# Altium schematic sheet PROC051D_SOP_Headers_Reference.SchDoc
size 431 x 279 mm; Date: Not shown in title block; ApprovedBy: Not shown in title block; CheckedBy: Not shown in title block; Author: Not shown in title block; CompanyName: Not shown in title block; Engineer: Not shown in title block; Organization: Not shown in title block; Address1: Not shown in title block; Address2: Not shown in title block; Address3: Not shown in title block; Address4: Not shown in title block; DocumentNumber: 7; Revision: Use project parameter SCH_Rev; SheetNumber: 7; SheetTotal: 16; PageSetup: Record=PageOptions|CenterHorizontal=True|CenterVertical=True|PrintScale=1.00|XCorrection=1.00|YCorrection=1.00|PrintKind=0|BorderSize=5000000|LeftOffset=0|BottomOffset=0|Orientation=2|PaperLength=1000|PaperWidth=1000|Scale=100|PaperSource=15|PrintQuality=600|MediaType=1|DitherType=10|PaperKind=Letter|PrintScaleMode=1; CurrentTime: Not shown in title block; CurrentDate: Not shown in title block; Time: Not shown in title block; DocumentFullPathAndName: Not shown in title block; DocumentName: Not shown in title block; ModifiedDate: Not shown in title block; ImagePath: Not shown in title block
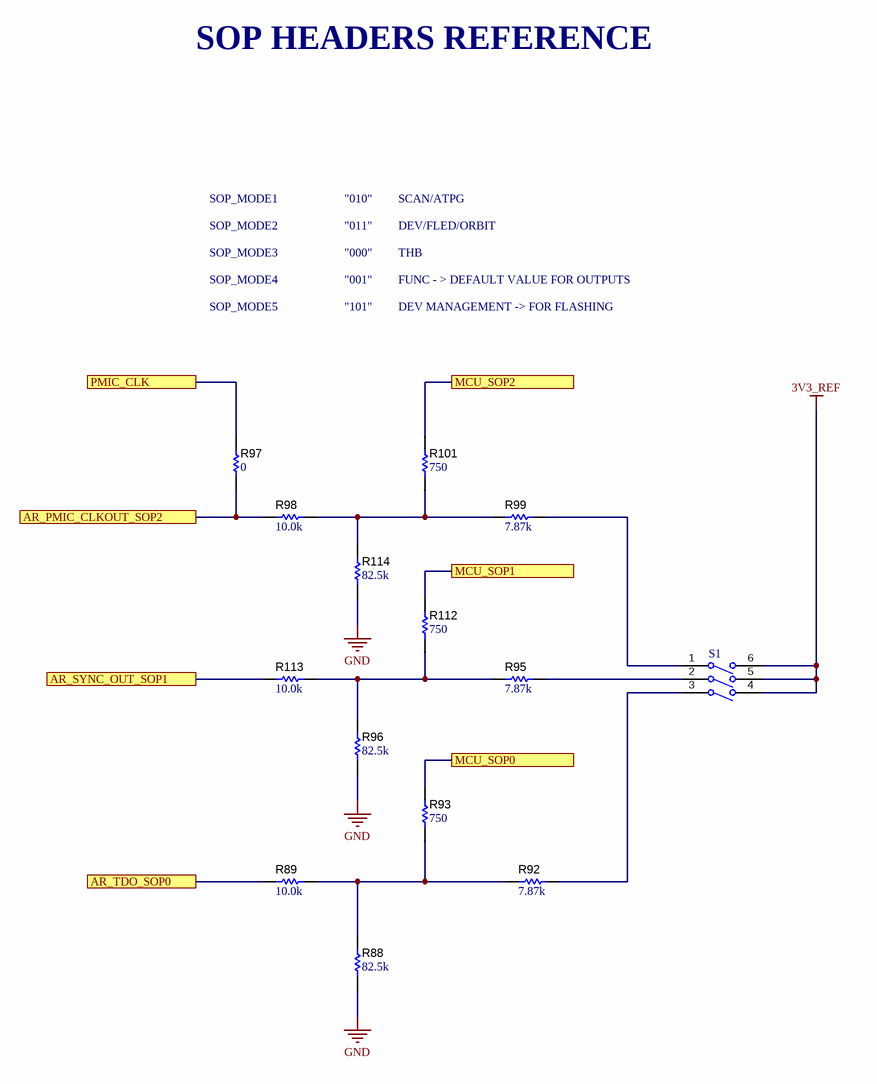
[diagram p0: PROC051D_SOP_Headers_Reference.SchDoc]

## Parts
R88  ValueDisplayed: 82.5k  [0402L]  (hidden comment: CRCW040282K5FKED)
R89  ValueDisplayed: 10.0k  [0402L]  (hidden comment: CRCW040210K0FKED)
R92  ValueDisplayed: 7.87k  [0402L]  (hidden comment: CRCW04027K87FKED)
R93  ValueDisplayed: 750  [0402L]  (hidden comment: CRCW0402750RFKED)
R95  ValueDisplayed: 7.87k  [0402L]  (hidden comment: CRCW04027K87FKED)
R96  ValueDisplayed: 82.5k  [0402L]  (hidden comment: CRCW040282K5FKED)
R97  ValueDisplayed: 0  [0402L]  (hidden comment: ERJ-2GE0R00X)
R98  ValueDisplayed: 10.0k  [0402L]  (hidden comment: CRCW040210K0FKED)
R99  ValueDisplayed: 7.87k  [0402L]  (hidden comment: CRCW04027K87FKED)
R101  ValueDisplayed: 750  [0402L]  (hidden comment: CRCW0402750RFKED)
R112  ValueDisplayed: 750  [0402L]  (hidden comment: CRCW0402750RFKED)
R113  ValueDisplayed: 10.0k  [0402L]  (hidden comment: CRCW040210K0FKED)
R114  ValueDisplayed: 82.5k  [0402L]  (hidden comment: CRCW040282K5FKED)
S1  219-3MST  [SW_219-3MST]  (value not drawn)

## Ports
AR_PMIC_CLKOUT_SOP2, AR_SYNC_OUT_SOP1, AR_TDO_SOP0, MCU_SOP0, MCU_SOP1, MCU_SOP2, PMIC_CLK

## Nets
3V3_REF: S1.4(B3) S1.5(B2) S1.6(B1)
GND: R88.1 R96.1 R114.1
AR_PMIC_CLKOUT_SOP2: R97.1 R98.1 ; port AR_PMIC_CLKOUT_SOP2
AR_SYNC_OUT_SOP1: R113.1 ; port AR_SYNC_OUT_SOP1
AR_TDO_SOP0: R89.1 ; port AR_TDO_SOP0
MCU_SOP0: R93.2 ; port MCU_SOP0
MCU_SOP1: R112.2 ; port MCU_SOP1
MCU_SOP2: R101.2 ; port MCU_SOP2
PMIC_CLK: R97.2 ; port PMIC_CLK
NetR88_2: R88.2 R89.2 R92.1 R93.1
NetR92_2: R92.2 S1.3(A3)
NetR95_1: R95.1 R96.2 R112.1 R113.2
NetR95_2: R95.2 S1.2(A2)
NetR98_2: R98.2 R99.1 R101.1 R114.2
NetR99_2: R99.2 S1.1(A1)

## Notes on the sheet
- SOP HEADERS REFERENCE
- SOP_MODE1
- "010"
- SCAN/ATPG
- SOP_MODE2
- SOP_MODE3
- "011"
- "000"
- DEV/FLED/ORBIT
- THB
- SOP_MODE4
- SOP_MODE5
- "001"
- "101"
- FUNC - > DEFAULT VALUE FOR OUTPUTS
- DEV MANAGEMENT -> FOR FLASHING
- Drawn By:
- SVN Rev:
- Number:
- TID #:
- Orderable:
- Rev:
- Sheet Title:
- File:
- Project Title:
- Designed for:
- Assembly Variant:
- Mod. Date:
- Sheet:
- Size:
- of
- B
- http://www.ti.com
- Texas Instruments and/or its licensors do not warrant the accuracy or completeness of this specification or any information contained therein. Texas Instruments and/or its licensors do not warrant that this design will meet the specifications, will be suitable for your application or fit for any particular purpose, or will operate in an implementation. Texas Instruments and/or its licensors do not warrant that the design is production worthy. You should completely validate and test your design implementation to confirm the system functionality for your application.
- Engineer:
- Contact:
- © Texas Instruments

## Library data of the parts
R88 R96 R114 = CMP-0026574-2: RES, 82.5 k, 1%, 0.063 W, AEC-Q200 Grade 0, 0402; Manufacturer: Vishay-Dale; Power_W: 63mW; TempCo: 100 ppm/C; Value_Code: 82k5; Value: 82.5k; EIA_Code: E96; SizeX_mm: 1; SizeY_mm: 0.5; SizeZ_mm: 0.6; Value2: 0.063W; AEC Qualified: Y; VDC_V: 50V; AEC Grade: 0; AEC Category: Q200; ComponentLink1URL: http://www.vishay.com/docs/20035/dcrcwe3.pdf; Supplier Part Number 2: 52K7304; Supplier 2: Newark; Supplier Part Number 3: 71-CRCW0402-82.5K-E3; Supplier 3: Mouser; RoHS: E; Value1: 1%; MountType: SMT; Supplier 1: Digi-Key; PackageReference: 0402; Tolerance_%: 1%; Res_ohm: 82.5k; SizeArea_mm2: 0.5; CompType: Resistor; PartNumber: CRCW040282K5FKED; ComponentLink1Description: Datasheet link; Supplier Part Number 1: 541-82.5KLCT-ND; Technology: Thick Film
R89 R98 R113 = CMP-0025958-3: RES, 10.0 k, 1%, 0.063 W, AEC-Q200 Grade 0, 0402; Manufacturer: Vishay-Dale; Power_W: 63mW; TempCo: 100 ppm/C; Value_Code: 10k0; Value: 10.0k; EIA_Code: E96; Res_ohm: 10k; SizeX_mm: 1; SizeY_mm: 0.5; SizeZ_mm: 0.6; Value2: 0.063W; AEC Qualified: Y; VDC_V: 50V; AEC Category: Q200; AEC Grade: 0; Supplier Part Number 2: 52K6595; Supplier 2: Newark; Supplier Part Number 3: 71-CRCW0402-10K-E3; Supplier 3: Mouser; RoHS: E; Value1: 1%; MountType: SMT; Supplier 1: Digi-Key; PackageReference: 0402; Tolerance_%: 1%; SizeArea_mm2: 0.5; CompType: Resistor; PartNumber: CRCW040210K0FKED; ComponentLink1Description: Datasheet link; Supplier Part Number 1: 541-10.0KLCT-ND; Technology: Thick Film; ComponentLink1URL: http://www.vishay.com/docs/20035/dcrcwe3.pdf
R92 R95 R99 = CMP-0026557-2: RES, 7.87 k, 1%, 0.063 W, AEC-Q200 Grade 0, 0402; Manufacturer: Vishay-Dale; Power_W: 63mW; TempCo: 100 ppm/C; Value_Code: 7k87; Value: 7.87k; EIA_Code: E96; SizeX_mm: 1; SizeY_mm: 0.5; SizeZ_mm: 0.6; Value2: 0.063W; AEC Qualified: Y; VDC_V: 50V; AEC Grade: 0; AEC Category: Q200; ComponentLink1URL: http://www.vishay.com/docs/20035/dcrcwe3.pdf; Supplier Part Number 2: 52K7249; Supplier 2: Newark; Supplier Part Number 3: 71-CRCW0402-7.87K-E3; Supplier 3: Mouser; RoHS: E; Value1: 1%; MountType: SMT; Supplier 1: Digi-Key; PackageReference: 0402; Tolerance_%: 1%; Res_ohm: 7.87k; SizeArea_mm2: 0.5; CompType: Resistor; PartNumber: CRCW04027K87FKED; ComponentLink1Description: Datasheet link; Supplier Part Number 1: 541-7.87KLCT-ND; Technology: Thick Film
R93 R101 R112 = CMP-0026542-2: RES, 750, 1%, 0.063 W, AEC-Q200 Grade 0, 0402; Manufacturer: Vishay-Dale; Power_W: 63mW; TempCo: 100 ppm/C; Value_Code: 750R; Value: 750; EIA_Code: E96; SizeX_mm: 1; SizeY_mm: 0.5; SizeZ_mm: 0.6; Value2: 0.063W; AEC Qualified: Y; VDC_V: 50V; AEC Grade: 0; AEC Category: Q200; ComponentLink1URL: http://www.vishay.com/docs/20035/dcrcwe3.pdf; Supplier Part Number 2: 52K7270; Supplier 2: Newark; Supplier Part Number 3: 71-CRCW0402-750-E3; Supplier 3: Mouser; RoHS: E; Value1: 1%; MountType: SMT; Supplier 1: Digi-Key; PackageReference: 0402; Tolerance_%: 1%; Res_ohm: 750; SizeArea_mm2: 0.5; CompType: Resistor; PartNumber: CRCW0402750RFKED; ComponentLink1Description: Datasheet link; Supplier Part Number 1: 541-750LCT-ND; Technology: Thick Film
R97 = CMP-0026992-3: RES, 0, 5%, 0.1 W, AEC-Q200 Grade 0, 0402; Manufacturer: Panasonic; Power_W: 100mW; TempCo: 600 ppm/C; Value_Code: 0000; Value: 0; EIA_Code: E24; SizeX_mm: 1; SizeY_mm: 0.5; SizeZ_mm: 0.6; Value2: 0.1W; AEC Qualified: Y; VDC_V: 50V; AEC Category: Q200; SizeAreaWB_mm2: 3; Supplier Part Number 2: 65T8307; Supplier 2: Newark; Supplier Part Number 3: 667-ERJ-2GE0R00X; Supplier 3: Mouser; RoHS: Y; Value1: 5%; MountType: SMT; Supplier 1: Digi-Key; PackageReference: 0402; Tolerance_%: 5%; Res_ohm: 0; SizeArea_mm2: 0.5; CompType: Resistor; PartNumber: ERJ-2GE0R00X; ComponentLink1Description: Datasheet link; Supplier Part Number 1: P0.0JCT-ND; Technology: Thick Film; ComponentLink1URL: https://industrial.panasonic.com/cdbs/www-data/pdf/RDA0000/AOA0000C301.pdf; AEC Grade: 0
S1 = CMP-0002269-1: Switch, SPST, Slide, Off-On, 3 Pos, 0.1A, 20V, SMD; Manufacturer: CTS Electrocomponents; CurrentRating_mA: 100A; PositionCount: 3; Supplier 2: Mouser; Supplier 1: Digi-Key; Supplier Part Number 1: CT2193MST-ND; Supplier Part Number 2: 774-2193MST; PartNumber: 219-3MST; ComponentLink1Description: Datasheet Link; LatestRevisionDate: 2017-03-09; ComponentLink1URL: http://www.ctscorp.com/wp-content/uploads/2015/11/219.pdf; CompType: Switch; PackageReference: 6.7x9.09mm; Publisher: Texas Instruments; Circuit: SPST; VDC_V: 20V; RoHS: Y; Orientation: Horizontal; SwitchFunction: Off-On; MountType: SMT